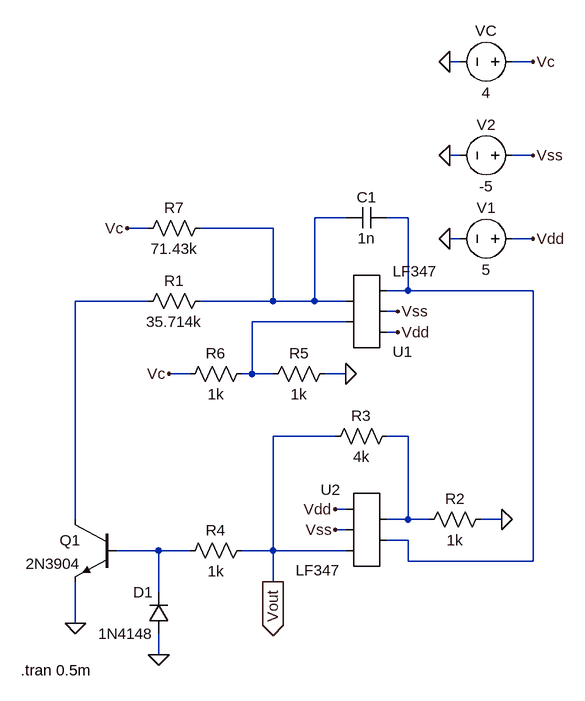
[diagram p0: schematic Voltage controlled oscillator.asc]
Voltage controlled oscillator.asc, the LTspice schematic file:
Version 4
SHEET 1 880 680
WIRE 352 -368 336 -368
WIRE 464 -368 432 -368
WIRE 352 -224 336 -224
WIRE 464 -224 432 -224
WIRE 176 -128 128 -128
WIRE 272 -128 240 -128
WIRE -128 -112 -160 -112
WIRE 64 -112 -48 -112
WIRE 352 -96 336 -96
WIRE 464 -96 432 -96
WIRE 272 -16 272 -128
WIRE 272 -16 240 -16
WIRE 464 -16 272 -16
WIRE -128 0 -240 0
WIRE 64 0 64 -112
WIRE 64 0 -48 0
WIRE 128 0 128 -128
WIRE 128 0 64 0
WIRE 176 0 128 0
WIRE 256 16 240 16
WIRE 176 32 32 32
WIRE 256 48 240 48
WIRE -64 112 -96 112
WIRE 32 112 32 32
WIRE 32 112 16 112
WIRE 64 112 32 112
WIRE 176 112 144 112
WIRE 160 208 64 208
WIRE 272 208 240 208
WIRE 176 320 160 320
WIRE -240 336 -240 0
WIRE 272 336 272 208
WIRE 272 336 240 336
WIRE 304 336 272 336
WIRE 416 336 384 336
WIRE 176 352 160 352
WIRE 272 368 240 368
WIRE -112 384 -176 384
WIRE -64 384 -112 384
WIRE 64 384 64 208
WIRE 64 384 16 384
WIRE 176 384 64 384
WIRE 272 400 272 368
WIRE 464 400 464 -16
WIRE 464 400 272 400
WIRE 64 432 64 384
WIRE -112 448 -112 384
WIRE -240 496 -240 432
WIRE -112 544 -112 512
FLAG 336 -96 0
FLAG 336 -224 0
FLAG 464 -96 Vdd
FLAG 464 -224 Vss
FLAG 256 48 Vdd
FLAG 160 320 Vdd
FLAG 256 16 Vss
FLAG 160 352 Vss
FLAG 336 -368 0
FLAG 176 112 0
FLAG 464 -368 Vc
FLAG -160 -112 Vc
FLAG -96 112 Vc
FLAG -240 496 0
FLAG -112 544 0
FLAG 416 336 0
FLAG 64 432 Vout
IOPIN 64 432 Out
SYMBOL AutoGenerated\\LF347 208 16 M180
SYMATTR InstName U1
SYMBOL AutoGenerated\\LF347 208 352 M0
SYMATTR InstName U2
SYMBOL cap 240 -144 R90
WINDOW 0 0 32 VBottom 2
WINDOW 3 32 32 VTop 2
SYMATTR InstName C1
SYMATTR Value 1n
SYMBOL res 400 320 R90
WINDOW 0 0 56 VBottom 2
WINDOW 3 32 56 VTop 2
SYMATTR InstName R2
SYMATTR Value 1k
SYMBOL res 256 192 R90
WINDOW 0 0 56 VBottom 2
WINDOW 3 32 56 VTop 2
SYMATTR InstName R3
SYMATTR Value 4k
SYMBOL voltage 448 -96 R90
WINDOW 0 -32 56 VBottom 2
WINDOW 3 32 56 VTop 2
WINDOW 123 0 0 Left 0
WINDOW 39 0 0 Left 0
SYMATTR InstName V1
SYMATTR Value 5
SYMBOL voltage 448 -224 R90
WINDOW 0 -32 56 VBottom 2
WINDOW 3 32 56 VTop 2
WINDOW 123 0 0 Left 0
WINDOW 39 0 0 Left 0
SYMATTR InstName V2
SYMATTR Value -5
SYMBOL diode -96 512 R180
WINDOW 0 24 64 Left 2
WINDOW 3 24 0 Left 2
SYMATTR InstName D1
SYMATTR Value 1N4148
SYMBOL res 32 368 R90
WINDOW 0 0 56 VBottom 2
WINDOW 3 32 56 VTop 2
SYMATTR InstName R4
SYMATTR Value 1k
SYMBOL voltage 448 -368 R90
WINDOW 0 -32 56 VBottom 2
WINDOW 3 32 56 VTop 2
WINDOW 123 0 0 Left 0
WINDOW 39 0 0 Left 0
SYMATTR InstName VC
SYMATTR Value 4
SYMBOL res 32 96 R90
WINDOW 0 0 56 VBottom 2
WINDOW 3 32 56 VTop 2
SYMATTR InstName R6
SYMATTR Value 1k
SYMBOL res 160 96 R90
WINDOW 0 0 56 VBottom 2
WINDOW 3 32 56 VTop 2
SYMATTR InstName R5
SYMATTR Value 1k
SYMBOL res -32 -16 R90
WINDOW 0 0 56 VBottom 2
WINDOW 3 32 56 VTop 2
SYMATTR InstName R1
SYMATTR Value 35.714k
SYMBOL res -32 -128 R90
WINDOW 0 0 56 VBottom 2
WINDOW 3 32 56 VTop 2
SYMATTR InstName R7
SYMATTR Value 71.43k
SYMBOL npn -176 336 M0
SYMATTR InstName Q1
SYMATTR Value 2N3904
TEXT -324 568 Left 2 !.tran 0.5m

The netlist it stands for:
* Voltage controlled oscillator.asc
* U1: LF347 (symbol AutoGenerated\LF347 not available, pins judged from their places): pin1=N004 pin2=N001 pin3=Vdd pin4=Vss pin5=N002
* U2: LF347 (symbol AutoGenerated\LF347 not available, pins judged from their places): pin1=N005 pin2=N002 pin3=Vdd pin4=Vss pin5=Vout
C1 N002 N001 1n
R2 0 N005 1k
R3 N005 Vout 4k
V1 Vdd 0 5
V2 Vss 0 -5
D1 0 N006 1N4148
R4 Vout N006 1k
VC Vc 0 4
R6 N004 Vc 1k
R5 0 N004 1k
R1 N001 N003 35.714k
R7 N001 Vc 71.43k
Q1 N003 N006 0 0 2N3904
.model D D
.lib standard.dio
.model NPN NPN
.model PNP PNP
.lib standard.bjt
.tran 0.5m
.backanno
.end